# EAGLE design XBeeThermSMD (EAGLE 6.4)
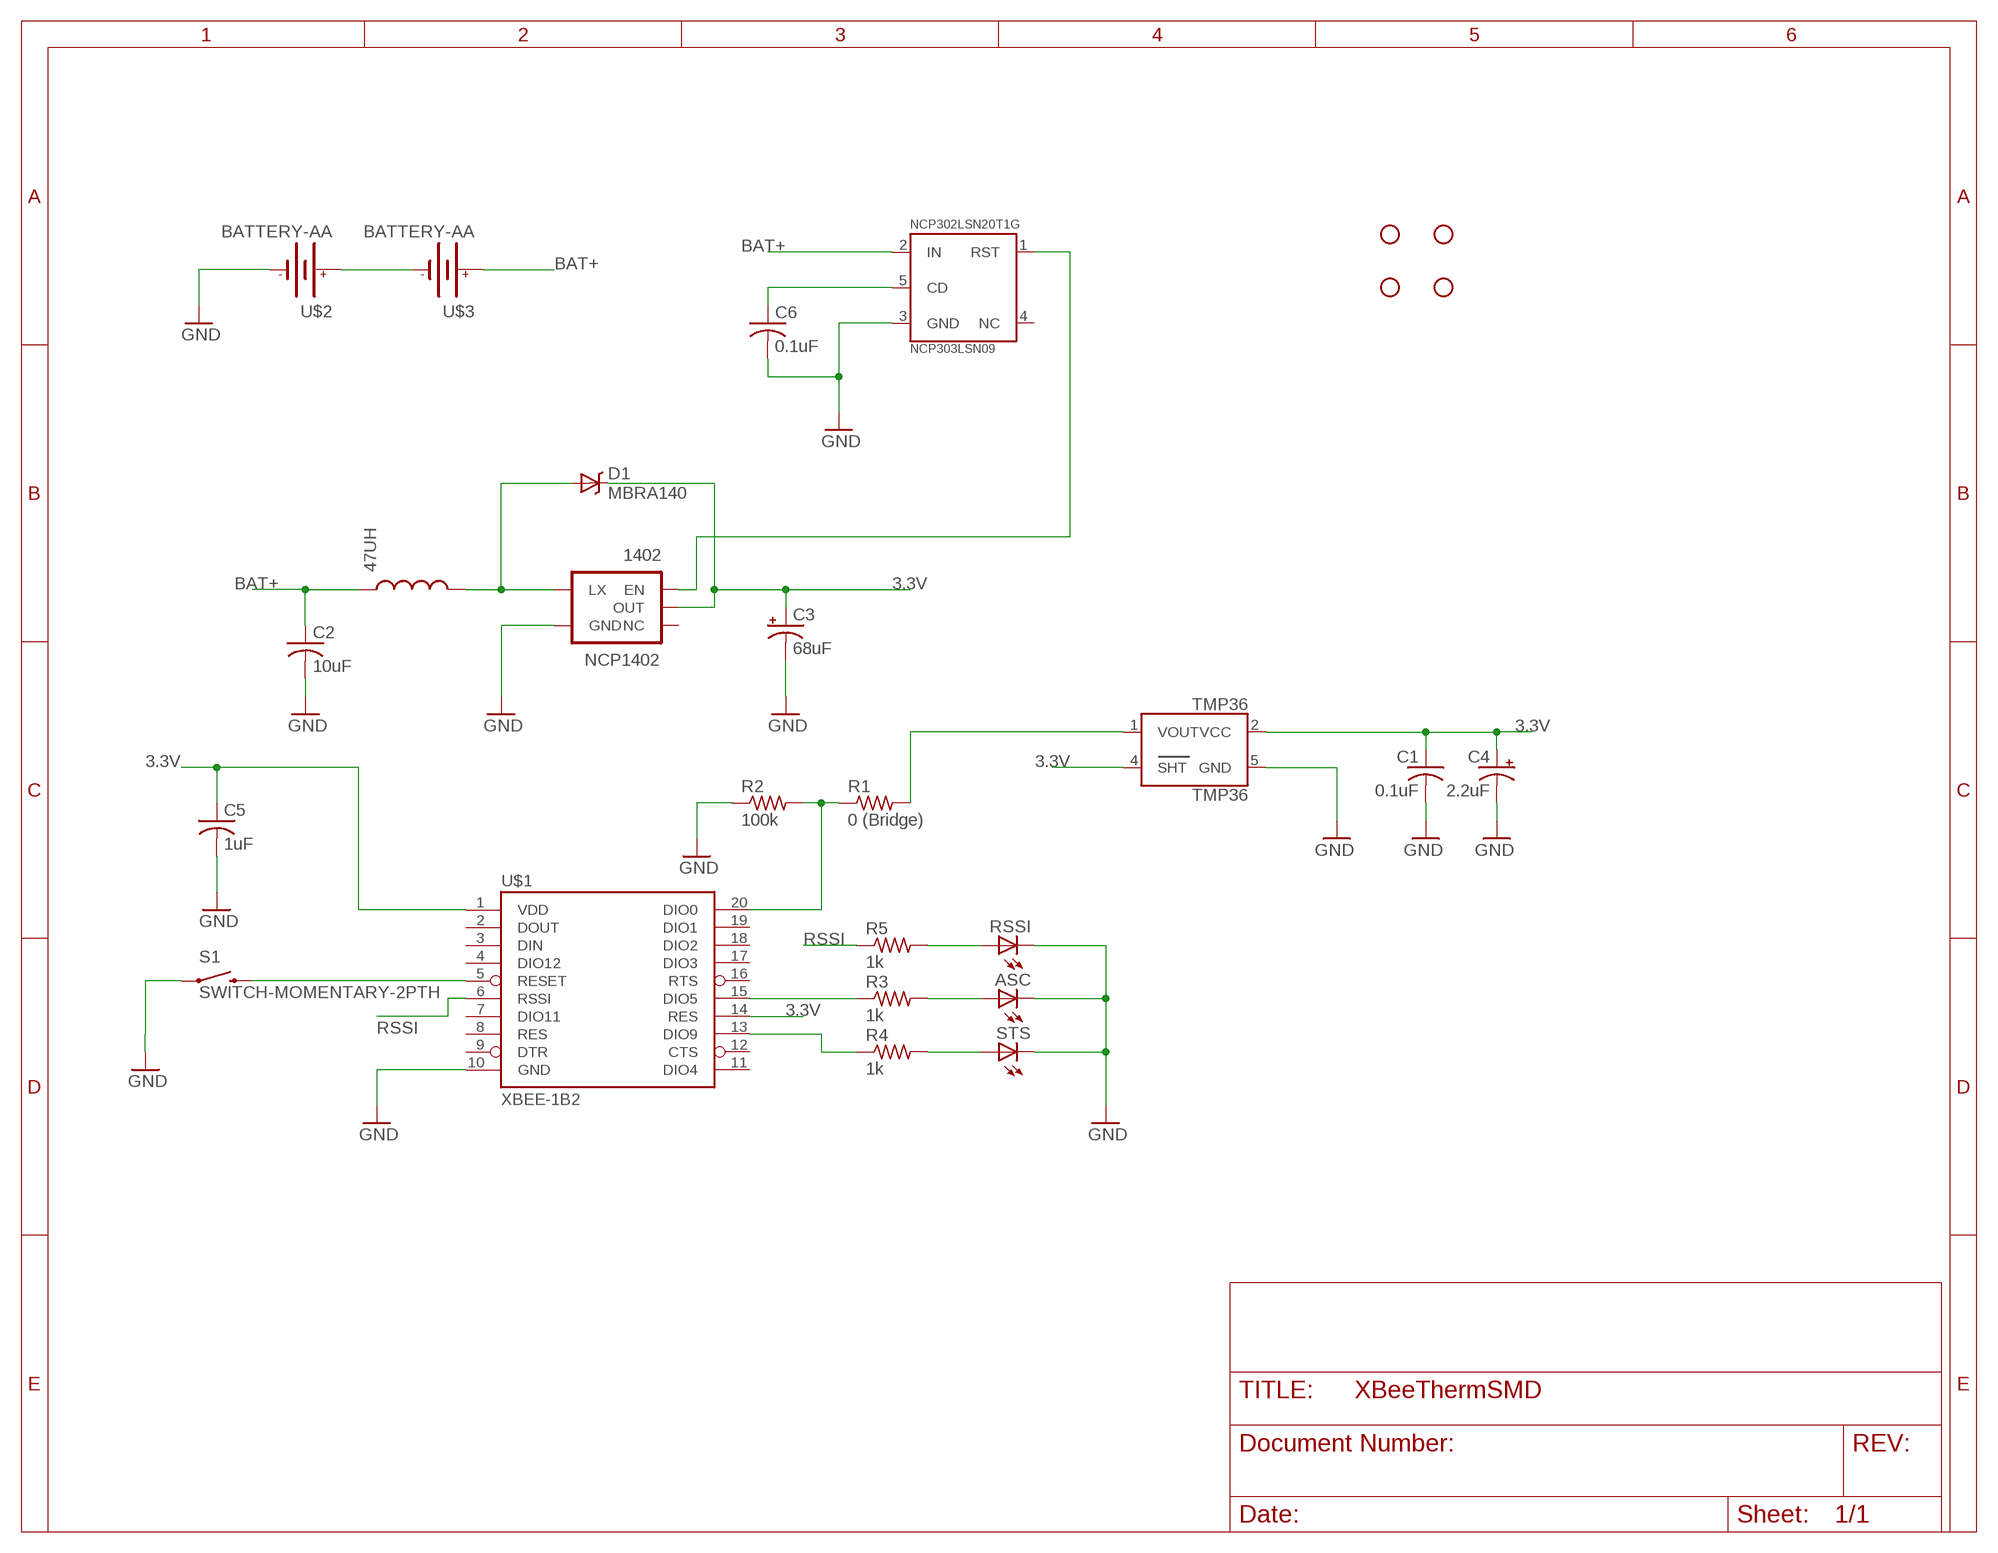
[diagram p0: schematic, sheet 1]

## Parts
47UH  INDUCTORCR54  [CR54]
1402  NCP1402  V_REG_NCP1400SOT23-5  [SOT23-5]
ASC  LEDCHIP-LED0603  [CHIP-LED0603]
C1  0.1uF  C-USC0402  [C0402]
C2  10uF  C-USC0805  [C0805]
C3  68uF  CPOL-USCT3216  [CT3216]
C4  2.2uF  CPOL-USR/2012-12R  [R/2012-12R]
C5  1uF  C-USC0805  [C0805]
C6  0.1uF  C-USC0402  [C0402]
D1  MBRA140  [SMA-DIODE]
NCP302LSN20T1G  NCP303LSN09  [SOT23-5]
R1  0 (Bridge)  R-US_R0603  [R0603]
R2  100k  R-US_R0603  [R0603]
R3  1k  R-US_R0603  [R0603]
R4  1k  R-US_R0603  [R0603]
R5  1k  R-US_R0603  [R0603]
RSSI  LEDCHIP-LED0603  [CHIP-LED0603]
S1  SWITCH-MOMENTARY-2PTH  [TACTILE-PTH]
STANDOFF1  STAND-OFF  [STAND-OFF]
STANDOFF2  STAND-OFF  [STAND-OFF]
STANDOFF3  STAND-OFF  [STAND-OFF]
STANDOFF4  STAND-OFF  [STAND-OFF]
STS  LEDCHIP-LED0603  [CHIP-LED0603]
TMP36  TMP36  [SOT23-5]
U$1  XBEE-1B2  [XBEE-SILK]
U$2  BATTERY-AA  [BATTERY_AA_CLIPS]
U$3  BATTERY-AA  [BATTERY_AA_CLIPS]

## Nets
3.3V [VCC]: 1402.2(OUT) C1.1 C3.+ C4.+ C5.1 D1.C TMP36.2(VCC) TMP36.4(SHT) U$1.1(VDD) U$1.14(RES)
BAT+ [BAT+]: 47UH.P$1 C2.1 NCP302LSN20T1G.2(IN) U$3.PWR@1(+) U$3.PWR@2(+)
GND [Ground]: 1402.4(GND) ASC.C C1.2 C2.2 C3.- C4.- C5.2 C6.2 NCP302LSN20T1G.3(GND) R2.1 RSSI.C S1.1 STS.C TMP36.5(GND) U$1.10(GND) U$2.GND@1(-) U$2.GND@2(-)
N$1: 47UH.P$2 1402.5(LX) D1.A
N$2 [BAT+]: U$2.PWR@1(+) U$2.PWR@2(+) U$3.GND@1(-) U$3.GND@2(-)
N$3: R1.1 R2.2 U$1.20(DIO0)
N$4: R1.2 TMP36.1(VOUT)
N$5: R3.1 U$1.15(DIO5)
N$6: R4.1 U$1.13(DIO9)
N$7: ASC.A R3.2
N$8: R4.2 STS.A
N$10: S1.3 U$1.5(RESET)
N$11: C6.1 NCP302LSN20T1G.5(CD)
N$12: 1402.1(EN) NCP302LSN20T1G.1(RST)
N$13: R5.2 RSSI.A
RSSI: R5.1 U$1.6(RSSI)
Unconnected: 1402.3(NC) NCP302LSN20T1G.4(NC) U$1.2(DOUT) U$1.3(DIN) U$1.4(DIO12) U$1.7(DIO11) U$1.8(RES) U$1.9(DTR) U$1.11(DIO4) U$1.12(CTS) U$1.16(RTS) U$1.17(DIO3) U$1.18(DIO2) U$1.19(DIO1)

## Library data of the parts
47UH = SparkFun-Passives:INDUCTOR: Inductors Basic Inductor/Choke - 0603 and 1206. Footprints are not proven and vary greatly between part numbers.
1402 = SparkFun-PowerIC:V_REG_NCP1400: Switching step-up voltage regulator NCP1400 switiching regulator takes single cell AA and outputs 100mA at 3.3V or 5V with minimal number of external components.
ASC RSSI STS = led:LED: LED OSRAM: - CHIPLED LG R971, LG N971, LY N971, LG Q971, LY Q971, LO R971, LY R971 LH N974, LH R974 LS Q976, LO Q976, LY Q976 LO Q996 - Hyper CHIPLED LW Q18S LB Q993, LB Q99A, LB R99A - SideLED LS A670, LO A670, LY A670, LG A670, LP A670 LB A673, LV A673, LT A673, LW A673 LH A674 LY A675 LS A676, LA A676, LO A676, LY A676, LW A676 LS A679, LY A679, LG A679 - Hyper Micro SIDELED® LS Y876, LA Y876, LO Y876, LY Y876 LT Y87S - SmartLED LW L88C, LW L88S LB L89C, LB L89S, LG L890 LS L89K, LO L89K, LY L89K LS L896, LA L896, LO L896, LY L896 - TOPLED LS T670, LO T670, LY T670, LG T670, LP T670 LSG T670, LSP T670, LSY T670, LOP T670, LYG T670 LG T671, LOG T671, LSG T671 LB T673, LV T673, LT T673, LW T673 LH T674 LS T676, LA T676, LO T676, LY T676, LB T676, LH T676, LSB T676, LW T676 LB T67C, LV T67C, LT T67C, LS T67K, LO T67K, LY T67K, LW E67C LS E67B, LA E67B, LO E67B, LY E67B, LB E67C, LV E67C, LT E67C LW T67C LS T679, LY T679, LG T679 LS T770, LO T770, LY T770, LG T770, LP T770 LB T773, LV T773, LT T773, LW T773 LH T774 LS E675, LA E675, LY E675, LS T675 LS T776, LA T776, LO T776, LY T776, LB T776 LHGB T686 LT T68C, LB T68C - Hyper Mini TOPLED® LB M676 - Mini TOPLED Santana® LG M470 LS M47K, LO M47K, LY M47K Source: http://www.osram.convergy.de LUXEON: - LUMILED® LXK2-PW12-R00, LXK2-PW12-S00, LXK2-PW14-U00, LXK2-PW14-V00 LXK2-PM12-R00, LXK2-PM12-S00, LXK2-PM14-U00 LXK2-PE12-Q00, LXK2-PE12-R00, LXK2-PE12-S00, LXK2-PE14-T00, LXK2-PE14-U00 LXK2-PB12-K00, LXK2-PB12-L00, LXK2-PB12-M00, LXK2-PB14-N00, LXK2-PB14-P00, LXK2-PB14-Q00 LXK2-PR12-L00, LXK2-PR12-M00, LXK2-PR14-Q00, LXK2-PR14-R00 LXK2-PD12-Q00, LXK2-PD12-R00, LXK2-PD12-S00 LXK2-PH12-R00, LXK2-PH12-S00 LXK2-PL12-P00, LXK2-PL12-Q00, LXK2-PL12-R00 Source: www.luxeon.com KINGBRIGHT: KA-3528ASYC Source: www.kingbright.com
C1 C2 C5 = resistor:C-US: CAPACITOR, American symbol
C3 C4 = resistor:CPOL-US: POLARIZED CAPACITOR, American symbol
C6 = rcl:C-US: CAPACITOR, American symbol
D1 = SparkFun-DiscreteSemi:MBRA140: 40V, 1A Schottky rectifier SMA/DO-214AC package DIO-08053; PROD_ID: DIO-08053
NCP302LSN20T1G = SparkFun-DigitalIC:NCP303LSN09: Power-on uC reset controller
R1-R5 = resistor:R-US_: RESISTOR, American symbol
S1 = SparkFun-Electromechanical:SWITCH-MOMENTARY-2: Various NO switches- pushbuttons, reed, etc
STANDOFF1-STANDOFF4 = SparkFun-Electromechanical:STAND-OFF: #4 Stand Off This is the mechanical footprint for a #4 phillips button head screw. Use the keepout ring to avoid running the screw head into surrounding components. SKU : PRT-00447
TMP36 = Sensors:TMP36: Temperature Sensor http://dlnmh9ip6v2uc.cloudfront.net/datasheets/Sensors/Temp/TMP35_36_37.pdf
U$1 = SparkFun-RF:XBEE-1: Xbee module footprints SMT header is CONN-09042.
U$2 U$3 = Connectors_and_Brackets:BATTERY-AA

## Net classes
0 default: width 0.203 mm
1 Ground: width 0.508 mm
2 BAT+: width 0.508 mm
3 VCC: width 0.508 mm

## Board
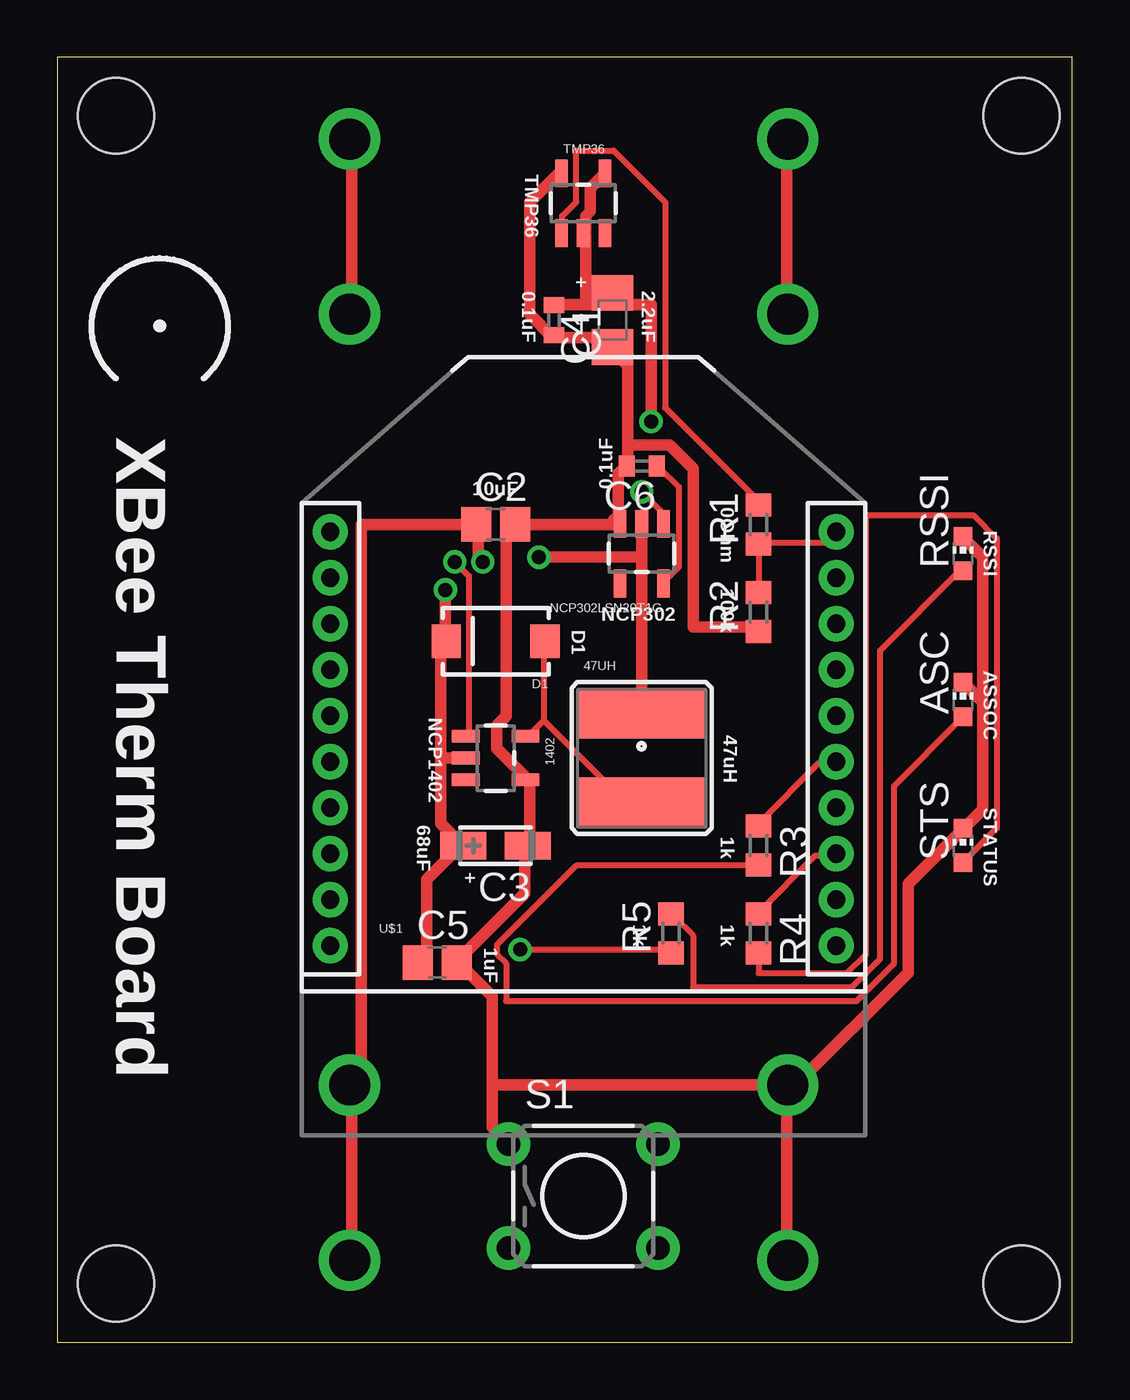
[diagram p1: board, top side]
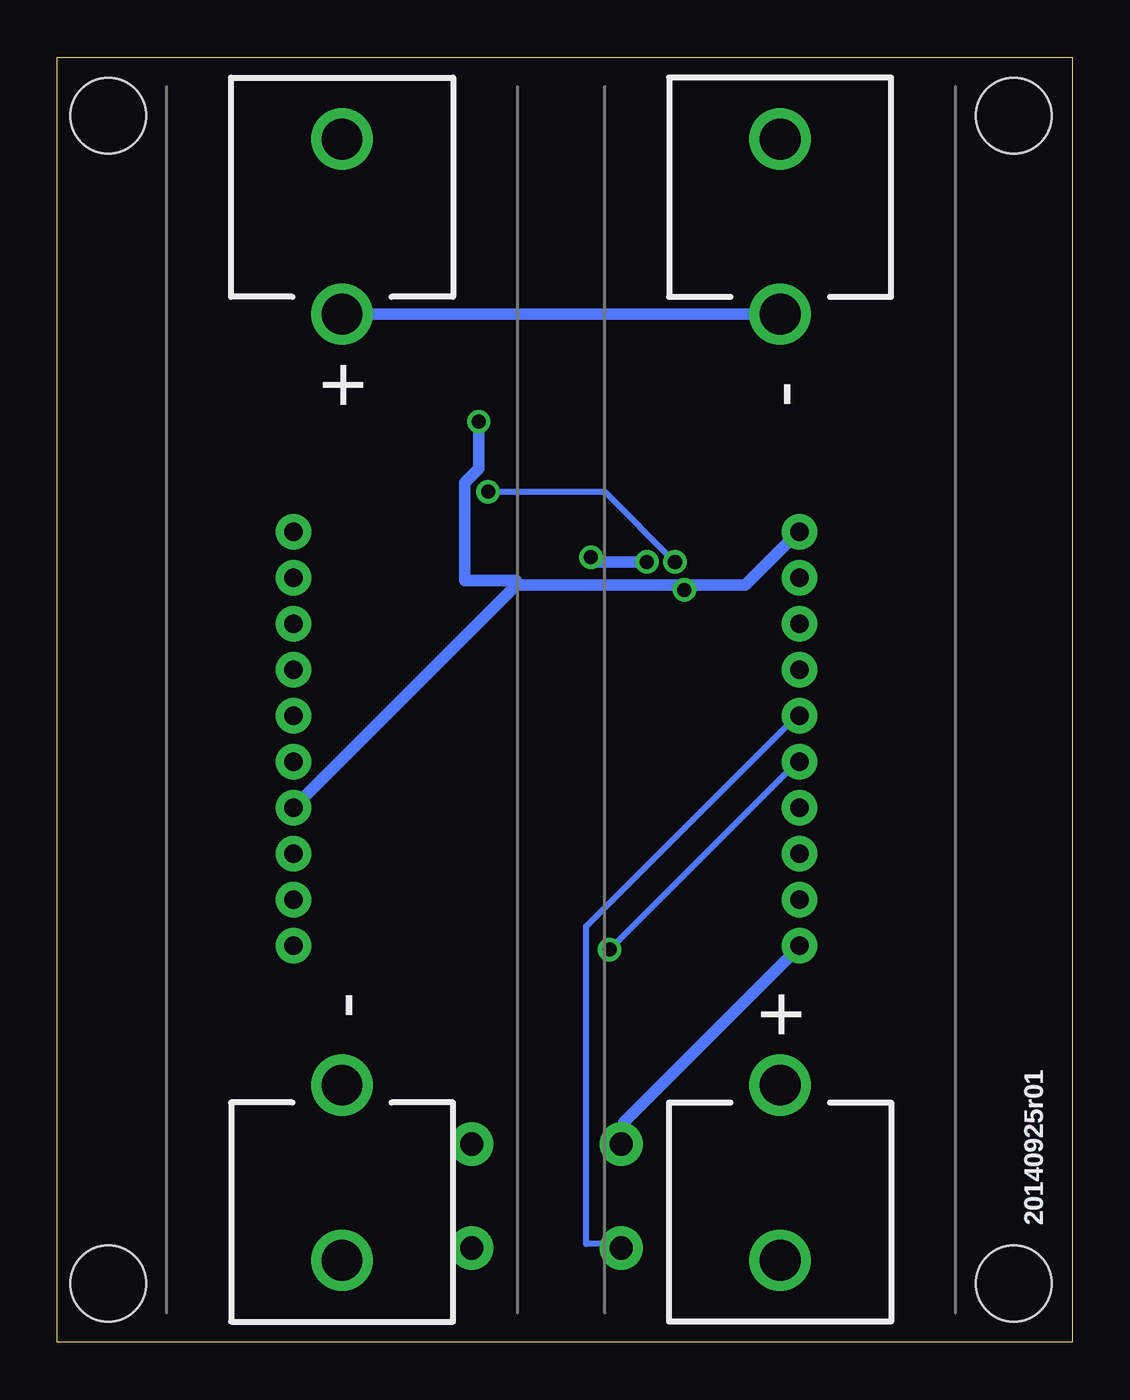
[diagram p2: board, bottom side, seen from below]

Size 44.12 x 55.87 mm. Coordinates in mm from the lower left corner, seen from the top.
Outline: 0,0 44.12,0 44.12,55.87 0,55.87 0,0
Copper layers (1*16): Top 0.035mm / dielectric 1.5mm / Bottom 0.035mm
Design rules "default *": minimum track width 10mil, minimum drill 24mil, track to track 8mil, track to pad 8mil, pad to pad 8mil, via to via 8mil, smd to smd 8mil, copper to edge 40mil, drill to drill 8mil, minimum pad ring 10mil, minimum via ring 8mil, stop-mask expansion 4mil, vias tented up to drill 25mil, thermal gap 10mil

### Footprints (pad centres in the part's own frame; a part is rotated, then mirrored left to right if it is on the bottom)
CR54 = smd 5.5 x 2.15: P$1 0,1.92; P$2 0,-1.92
SOT23-5 = smd 0.55 x 1.2: 1 -0.95,-1.3; 2 0,-1.3; 3 0.95,-1.3; 4 0.95,1.3; 5 -0.95,1.3
CHIP-LED0603 = smd 0.8 x 0.8: A 0,-0.75; C 0,0.75
C0402 = smd 0.7 x 0.9: 1 -0.65,0; 2 0.65,0
C0805 = smd 1.3 x 1.5: 1 -0.85,0; 2 0.85,0
CT3216 = smd 2 x 1.2: + 1.4,0; - -1.4,0
R/2012-12R = smd 1.55 x 1.8: + 1.175,0; - -1.175,0
SMA-DIODE = smd 1.27 x 1.47: A -2.15,0; C 2.15,0
R0603 = smd 1 x 1.1: 1 -0.85,0; 2 0.85,0
TACTILE-PTH = drill 1.016 pad 1.88: 1 -3.251,2.261; 2 3.251,2.261; 3 -3.251,-2.261; 4 3.251,-2.261
STAND-OFF = hole 3.302: 0,0
XBEE-SILK = drill 0.8 pad 1.524: 1 -11,20; 2 -11,18; 3 -11,16; 4 -11,14; 5 -11,12; 6 -11,10; 7 -11,8; 8 -11,6; 9 -11,4; 10 -11,2; 11 11,2; 12 11,4; 13 11,6; 14 11,8; 15 11,10; 16 11,12; 17 11,14; 18 11,16; 19 11,18; 20 11,20
BATTERY_AA_CLIPS = drill 1.778: GND@1 24.384,0; GND@2 16.764,0; PWR@1 -24.384,0; PWR@2 -16.764,0

### Placement (x,y rotation side)
47UH  25.4,25.4 0 top
1402  19.05,25.4 270 top
ASC  39.37,27.94 0 top
C1  21.59,44.45 270 top
C2  19.05,35.56 0 top
C3  19.05,21.59 180 top
C4  24.13,44.45 90 top
C5  16.51,16.51 0 top
C6  25.4,38.1 180 top
D1  19.05,30.48 180 top
NCP302LSN20T1G  25.4,34.29 180 top
R1  30.48,35.56 90 top
R2  30.48,31.75 90 top
R3  30.48,21.59 270 top
R4  30.48,17.78 270 top
R5  26.67,17.78 90 top
RSSI  39.37,34.29 0 top
S1  22.86,6.35 0 top
STANDOFF1  41.91,53.34 0 top
STANDOFF2  2.54,2.54 0 top
STANDOFF3  41.91,2.54 0 top
STANDOFF4  2.54,53.34 0 top
STS  39.37,21.59 0 top
TMP36  22.86,49.53 0 top
U$1  22.86,15.24 0 top
U$2  31.75,27.94 270 bottom
U$3  12.7,27.94 90 bottom

### Tracks (layer width: path | path; a pad name or v marks a point on that pad's centre or on a via)
3.3V  (via drill 0.61)
  Top 0.508: 16.66,25.4 1402.2 | 16.66,25.4 16.66,22.55 17.48,21.74 C3.+ 17.48,21.54 16.05,20.12 16.05,16.87 15.85,16.66 C5.1 | 16.66,25.4 16.66,30.28 16.87,30.48 D1.C 16.87,30.68 v16.87,32.72 | 22.96,45.11 23.98,45.11 23.98,45.52 C4.+ 24.18,45.11 25.81,45.11 v25.81,40.03 | 22.96,45.11 21.74,45.11 C1.1 | 22.96,45.11 22.96,48.16 TMP36.2 22.96,48.36 22.96,48.97 23.16,49.17 23.16,50.19 23.77,50.8 TMP36.4
  Bottom 0.508: 24.18,32.92 33.73,23.37 U$1.14 | 16.87,32.92 14.22,32.92 11.99,35.15 U$1.1 | 16.87,32.92 24.18,32.92 | v25.81,40.03 25.81,38 26.42,37.39 26.42,33.12 24.18,33.12 24.18,32.92 | v16.87,32.72 16.87,32.92
BAT+  (via drill 0.61)
  Top 0.508: 47UH.P$1 25.4,34.14 | 25.4,34.14 NCP302LSN20T1G.2 | U$3.PWR@1 12.8,3.66 12.8,10.97 U$3.PWR@2 12.8,11.18 13.21,11.58 13.21,35.56 C2.1 18.29,35.36 18.29,34.14 v18.49,33.93 | v20.93,34.14 25.4,34.14
  Bottom 0.508: v20.93,34.14 20.73,33.93 v18.49,33.93
GND
  Top 0.508: TMP36.5 21.74,50.8 20.52,49.58 20.52,44.7 21.54,43.69 C1.2 21.74,43.69 23.98,43.69 23.98,43.28 C4.- 24.18,43.08 24.79,42.47 24.79,39.01 | 24.79,39.01 26.62,39.01 27.64,38 27.64,31.09 30.48,31.09 R2.1 | 24.79,39.01 24.79,38.2 C6.2 24.59,38 24.38,37.8 24.38,35.76 NCP302LSN20T1G.3 24.18,35.76 24.18,35.56 C2.2 19.91,35.36 19.51,34.95 19.51,27.23 19.1,26.82 19.1,25.81 20.32,24.59 1402.4 20.52,24.38 20.52,21.74 C3.- 20.32,21.54 20.32,19.51 17.48,16.66 C5.2 17.48,16.46 18.9,15.04 18.9,11.18 | 18.9,11.18 18.9,9.35 19.51,8.74 S1.1 | 40.23,27.84 40.23,23.16 39.42,22.35 STS.C 39.22,22.15 36.98,19.91 36.98,16.05 32.11,11.18 U$2.GND@2 | 40.23,27.84 39.42,28.65 ASC.C | 40.23,27.84 40.23,34.14 39.42,34.95 RSSI.C | U$2.GND@1 31.7,3.66 31.7,10.97 U$2.GND@2 | U$2.GND@2 18.9,11.18
  Bottom 0.508: U$1.10 11.99,17.07 19.51,9.55 19.51,8.74 S1.1
N$1
  Top 0.254: 21.13,27.03 20.52,26.42 1402.5 | 21.13,27.03 21.13,30.48 D1.A | 21.13,27.03 24.59,23.57 25.4,23.57 47UH.P$2
N$2
  Top 0.508: U$3.GND@2 12.8,44.7 12.8,52.22 U$3.GND@1 | U$2.PWR@2 31.7,44.7 31.7,52.22 U$2.PWR@1
  Bottom 0.508: U$2.PWR@2 U$3.GND@2
N$3
  Top 0.254: R2.2 R1.1 30.48,34.75 33.73,34.75 33.73,35.15 U$1.20
N$4
  Top 0.254: R1.2 30.48,36.58 26.42,40.64 26.42,49.58 24.18,51.82 22.55,51.82 22.55,49.58 21.95,48.97 21.95,48.36 TMP36.1
N$5
  Top 0.254: R3.1 30.48,22.55 33.12,25.2 33.73,25.2 U$1.15
N$6
  Top 0.254: R4.1 30.48,18.69 32.92,21.13 33.73,21.13 U$1.13
N$7
  Top 0.254: ASC.A 39.22,27.03 36.37,24.18 36.37,16.46 34.75,14.83 19.51,14.83 19.51,16.46 19.1,16.87 19.1,17.27 22.55,20.73 30.48,20.73 R3.2
N$8
  Top 0.254: R4.2 30.48,16.05 34.34,16.05 35.15,16.87 35.15,35.97 39.83,35.97 40.84,34.95 40.84,22.35 39.42,20.93 STS.A
N$10
  Bottom 0.254: U$1.5 11.99,27.23 21.13,18.09 21.13,4.27 19.71,4.27 S1.3
N$11
  Top 0.254: C6.1 26.21,38 27.03,37.19 27.03,33.73 26.42,33.12 NCP302LSN20T1G.5
N$12  (via drill 0.61)
  Top 0.254: v17.27,33.93 17.88,33.33 17.88,26.42 1402.1 | v25.4,36.98 26.21,36.17 26.21,35.76 NCP302LSN20T1G.1
  Bottom 0.254: v17.27,33.93 20.32,36.98 v25.4,36.98
N$13
  Top 0.254: RSSI.A 39.22,33.53 35.76,30.07 35.76,16.66 34.54,15.44 27.64,15.44 27.64,17.68 26.82,18.49 R5.2
RSSI  (via drill 0.61)
  Top 0.254: v20.12,17.07 26.62,17.07 R5.1
  Bottom 0.254: v20.12,17.07 11.99,25.2 U$1.6

### Text on the board
Bottom: 20140925r01
tPlace: TMP36 | 0.1uF | + | 2.2uF | XBee Therm Board | 10uF | 0.1uF | 0Ohm | RSSI | 100k | D1 | NCP302 | ASSOC | NCP1402 | 47uH | STATUS | 68uF | 1k | + | 1k | 1k | 1uF
bPlace: 20140925r01